# EAGLE design airquality-schematic (EAGLE 9.6.2)
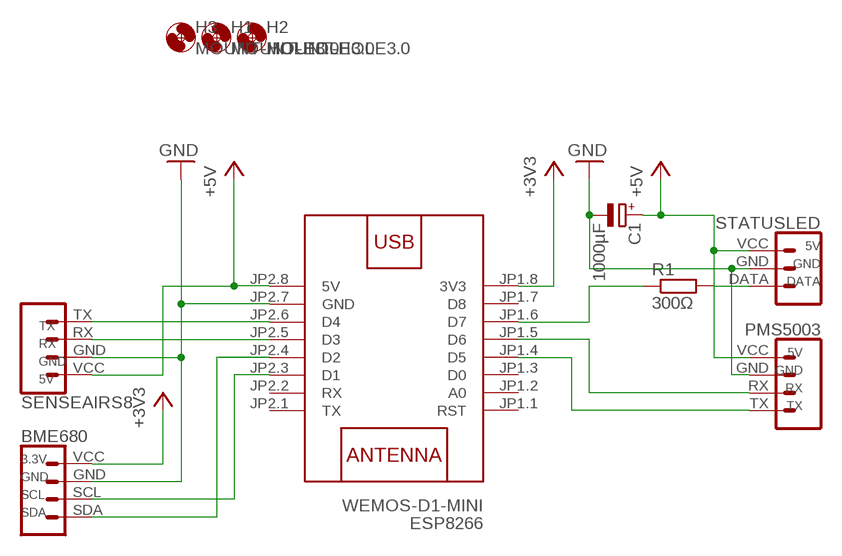
[diagram p0: schematic, sheet 1]

## Parts
BME680  BME680  [BME680]
C1  1000µF  CPOL-EUE5-10.5  [E5-10,5]
ESP8266  WEMOS-D1-MINI  [WEMOS-D1-MINI]
H1  MOUNT-HOLE3.0  [3,0]
H2  MOUNT-HOLE3.0  [3,0]
H3  MOUNT-HOLE3.0  [3,0]
PMS5003  PMS5003  [PMS5003]
R1  300Ω  R-EU_0207/10  [0207/10]
SENSEAIRS8  SENSEAIRS8  [SENSEAIRS8]
STATUSLED  LED  [LED]

## Nets
+3V3: BME680.VCC ESP8266.JP1.8(3V3)
+5V: C1.+ ESP8266.JP2.8(5V) PMS5003.VCC SENSEAIRS8.VCC STATUSLED.VCC
GND: BME680.GND C1.- ESP8266.JP2.7(GND) PMS5003.GND SENSEAIRS8.GND STATUSLED.GND
N$1: ESP8266.JP1.6(D7) R1.1
N$2: R1.2 STATUSLED.DATA
N$3: ESP8266.JP2.6(D4) SENSEAIRS8.TX
N$4: ESP8266.JP2.5(D3) SENSEAIRS8.RX
N$5: BME680.SCL ESP8266.JP2.3(D1)
N$6: BME680.SDA ESP8266.JP2.4(D2)
N$7: ESP8266.JP1.4(D5) PMS5003.TX
N$8: ESP8266.JP1.5(D6) PMS5003.RX
Unconnected: ESP8266.JP1.1(RST) ESP8266.JP1.2(A0) ESP8266.JP1.3(D0) ESP8266.JP1.7(D8) ESP8266.JP2.1(TX) ESP8266.JP2.2(RX)

## Library data of the parts
BME680 = AirQualityLib:BME680
C1 = rcl:CPOL-EU: POLARIZED CAPACITOR, European symbol; SPICEPREFIX: C
ESP8266 = AirQualityLib:WEMOS-D1-MINI: WEMOS D1 mini: Mini Wi-Fi Board based on ESP-8266 device More details can be found here: https://www.wemos.cc/product/d1-mini.html Click here to find device on ebay.com <http://www.ebay.com/sch/wemos+d1+mini+nodemcu>
H1-H3 = holes:MOUNT-HOLE: MOUNTING HOLE with drill center marker
PMS5003 = AirQualityLib:PMS5003
R1 = rcl:R-EU_: RESISTOR, European symbol; SPICEPREFIX: R
SENSEAIRS8 = AirQualityLib:SENSEAIRS8
STATUSLED = AirQualityLib:LED

## Board
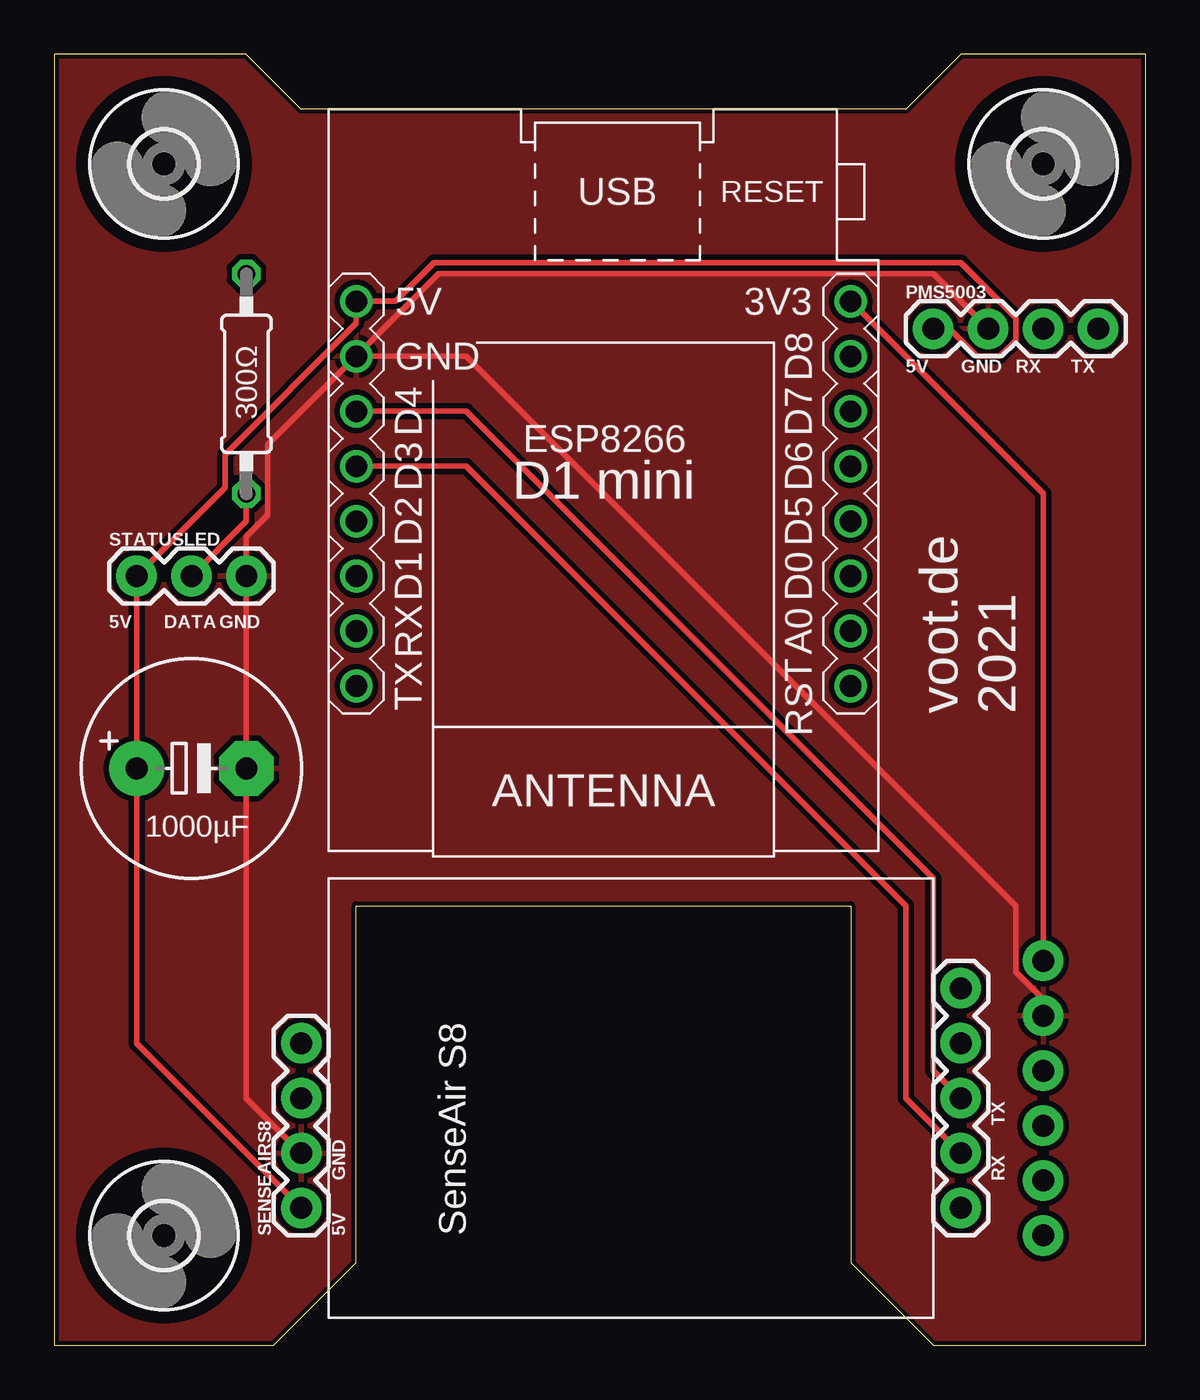
[diagram p1: board, top side]
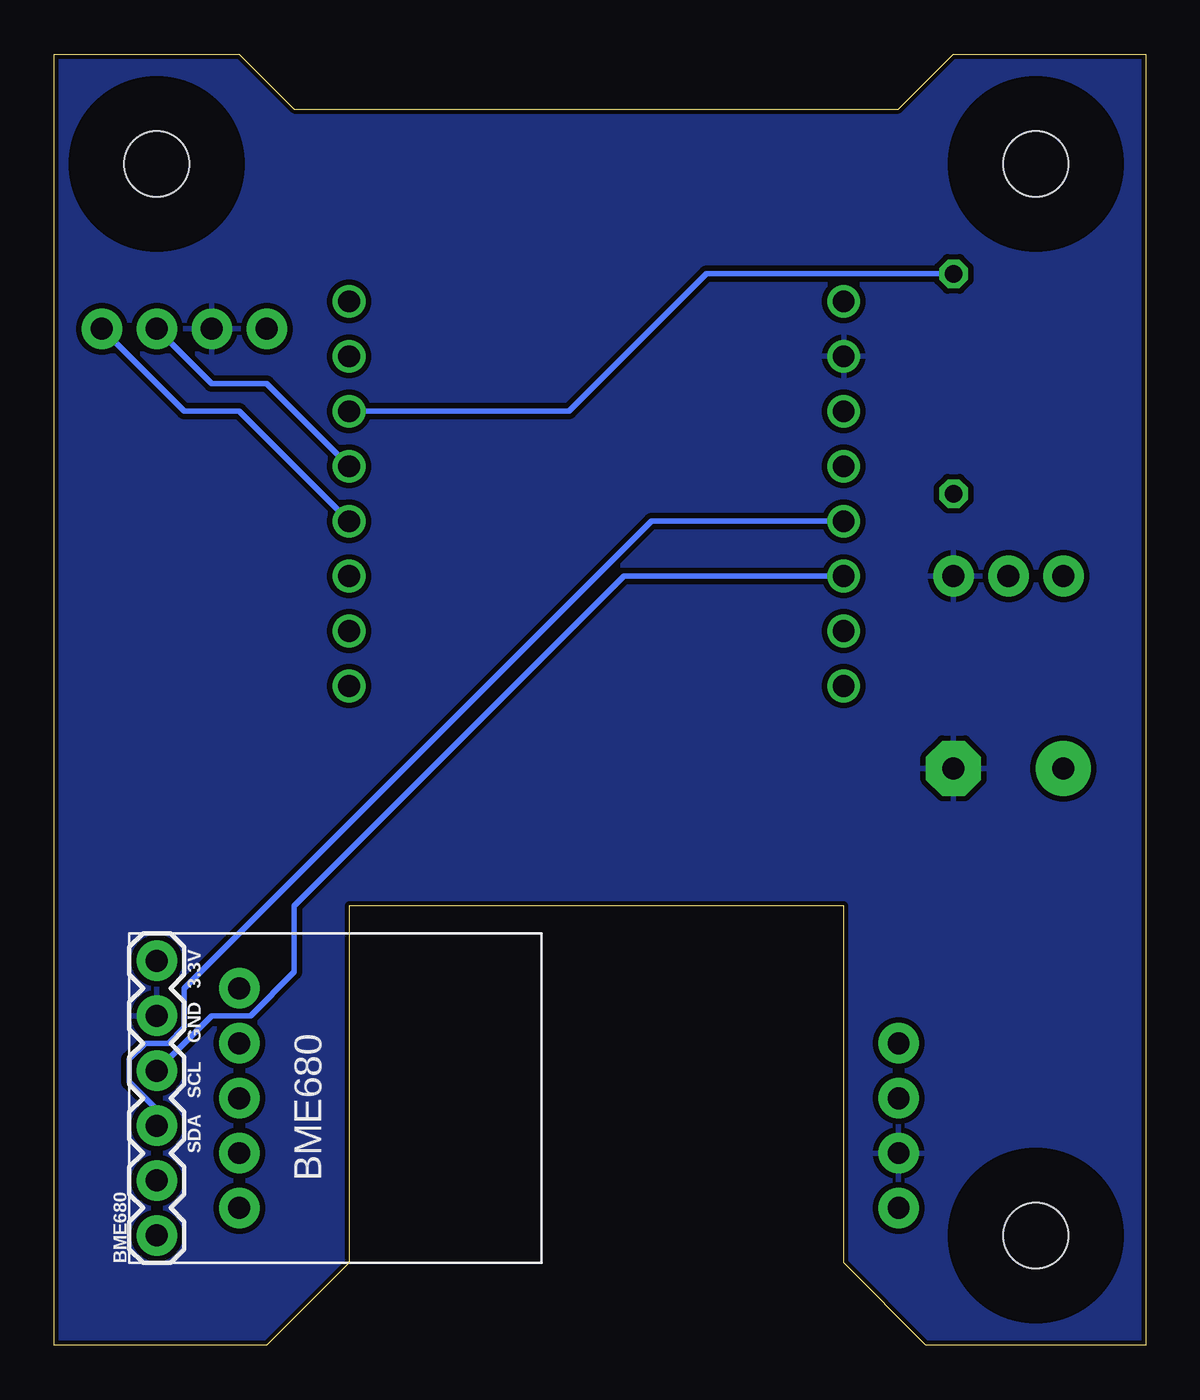
[diagram p2: board, bottom side, seen from below]

Size 50.47 x 59.69 mm. Coordinates in mm from the lower left corner, seen from the top.
Outline: 0,0 10.16,0 13.97,3.81 13.97,20.32 36.83,20.32 36.83,3.81 40.64,0 50.47,0 50.47,59.68 41.91,59.69 39.37,57.15 11.43,57.15 8.89,59.69 7.61,59.68 0,59.68 0,0
Copper layers (1*16): Top 0.035mm / dielectric 1.5mm / Bottom 0.035mm
Design rules "SparkFun-2-layer-STANDARD": minimum track width 10mil, minimum drill 20mil, track to track 10mil, track to pad 8mil, pad to pad 8mil, via to via 10mil, smd to smd 8mil, copper to edge 8mil, drill to drill 8mil, minimum pad ring 10mil, minimum via ring 10mil, stop-mask expansion 4mil, vias tented up to drill 25mil, thermal gap 10mil

### Footprints (pad centres in the part's own frame; a part is rotated, then mirrored left to right if it is on the bottom)
BME680 = drill 1.016 pad 1.88: 1 0,0; 2 2.54,0; GND 10.16,0; SCL 7.62,0; SDA 5.08,0; VCC 12.7,0
E5-10,5 = drill 1.016 pad 2.54: + -2.54,0 | drill 1.016 pad 2.54 octagon: - 2.54,0
WEMOS-D1-MINI = drill 1: JP1.1 -11.43,9.525; JP1.2 -11.43,6.985; JP1.3 -11.43,4.445; JP1.4 -11.43,1.905; JP1.5 -11.43,-0.635; JP1.6 -11.43,-3.175; JP1.7 -11.43,-5.715; JP1.8 -11.43,-8.255; JP2.1 11.43,9.525; JP2.2 11.43,6.985; JP2.3 11.43,4.445; JP2.4 11.43,1.905; JP2.5 11.43,-0.635; JP2.6 11.43,-3.175; JP2.7 11.43,-5.715; JP2.8 11.43,-8.255
3,0 = hole 3: 0,0
PMS5003 = drill 1.016 pad 1.88: GND 2.54,0; RX 5.08,0; TX 7.62,0; VCC 0,0
0207/10 = drill 0.813 octagon: 1 -5.08,0; 2 5.08,0
SENSEAIRS8 = drill 1.016 pad 1.88: 3 5.08,0; 4 7.62,0; 5 0,-30.48; 8 7.62,-30.48; 9 10.16,-30.48; GND 2.54,0; RX 2.54,-30.48; TX 5.08,-30.48; VCC 0,0
LED = drill 1.016 pad 1.88: DATA 2.54,0; GND 5.08,0; VCC 0,0

### Placement (x,y rotation side)
BME680  45.72,5.08 90 bottom
C1  6.35,26.67 0 top
ESP8266  25.4,40.01 180 top
H1  5.08,54.61 0 top
H2  5.08,5.08 0 top
H3  45.72,54.61 0 top
PMS5003  40.64,46.99 0 top
R1  8.89,44.45 270 top
SENSEAIRS8  11.43,6.35 90 top
STATUSLED  3.81,35.56 0 top

### Tracks (layer width: path | path; a pad name or v marks a point on that pad's centre or on a via)
+3V3
  Top 0.254: BME680.VCC 45.72,39.37 ESP8266.JP1.8
+5V
  Top 0.254: SENSEAIRS8.VCC 3.81,13.97 C1.+ STATUSLED.VCC 7.9,39.65 7.9,41.18 13.97,47.25 ESP8266.JP2.8 15.79,48.26 17.57,50.04 41.93,50.04 44.45,47.52 44.45,46.46 43.71,45.72 42.65,45.72 41.38,46.99 PMS5003.VCC
GND
  Top 0.254: ESP8266.JP2.7 9.88,41.63 9.88,38.37 8.89,37.38 STATUSLED.GND C1.- 8.89,11.43 SENSEAIRS8.GND | PMS5003.GND 40.64,49.53 17.78,49.53 ESP8266.JP2.7 | ESP8266.JP2.7 19.05,45.72 44.45,20.32 44.45,17.25 45.72,15.98 BME680.GND
  pour Top: 0,59.69 8.89,59.69 11.43,57.15 39.37,57.15 41.91,59.69 50.8,59.69 50.8,0 40.64,0 36.83,3.81 36.83,20.32 13.97,20.32 13.97,3.81 10.16,0 0,0
  pour Bottom: 0,59.69 8.89,59.69 11.43,57.15 39.37,57.15 41.91,59.69 50.8,59.69 50.8,0 40.64,0 36.83,3.81 36.83,20.32 13.97,20.32 13.97,3.81 10.16,0 0,0
N$1
  Bottom 0.254: ESP8266.JP1.6 26.67,43.18 20.32,49.53 R1.1
N$2
  Top 0.254: R1.2 8.89,38.1 STATUSLED.DATA
N$3
  Top 0.254: SENSEAIRS8.TX 40.64,12.7 40.64,21.59 19.05,43.18 ESP8266.JP2.6
N$4
  Top 0.254: SENSEAIRS8.RX 39.37,11.43 39.37,20.32 19.05,40.64 ESP8266.JP2.5
N$5
  Bottom 0.254: BME680.SCL 43.18,15.24 41.38,15.24 39.37,17.25 39.37,20.32 24.13,35.56 ESP8266.JP2.3
N$6
  Bottom 0.254: BME680.SDA 45.72,10.9 46.99,12.17 46.99,13.23 46.25,13.97 45.19,13.97 44.45,14.71 44.45,16.51 22.86,38.1 ESP8266.JP2.4
N$7
  Bottom 0.254: ESP8266.JP1.4 41.91,43.18 44.45,43.18 PMS5003.TX
N$8
  Bottom 0.254: ESP8266.JP1.5 40.64,44.45 43.18,44.45 PMS5003.RX

### Text on the board
tPlace: 300Ω | voot.de / 2021 | 1000µF